# Altium project MU-RK3576J-MB.PrjPCB (part 9 of 13)

## Sheet AUDIO.SchDoc
size 420 x 297 mm; Scale: 1:1; DocumentType: Схема электрическая принципиальная; SheetNumber: 27; SheetTotal: 32; DocumentTypeShort: Э3; DocumentInvertoryNumber: ㅤ
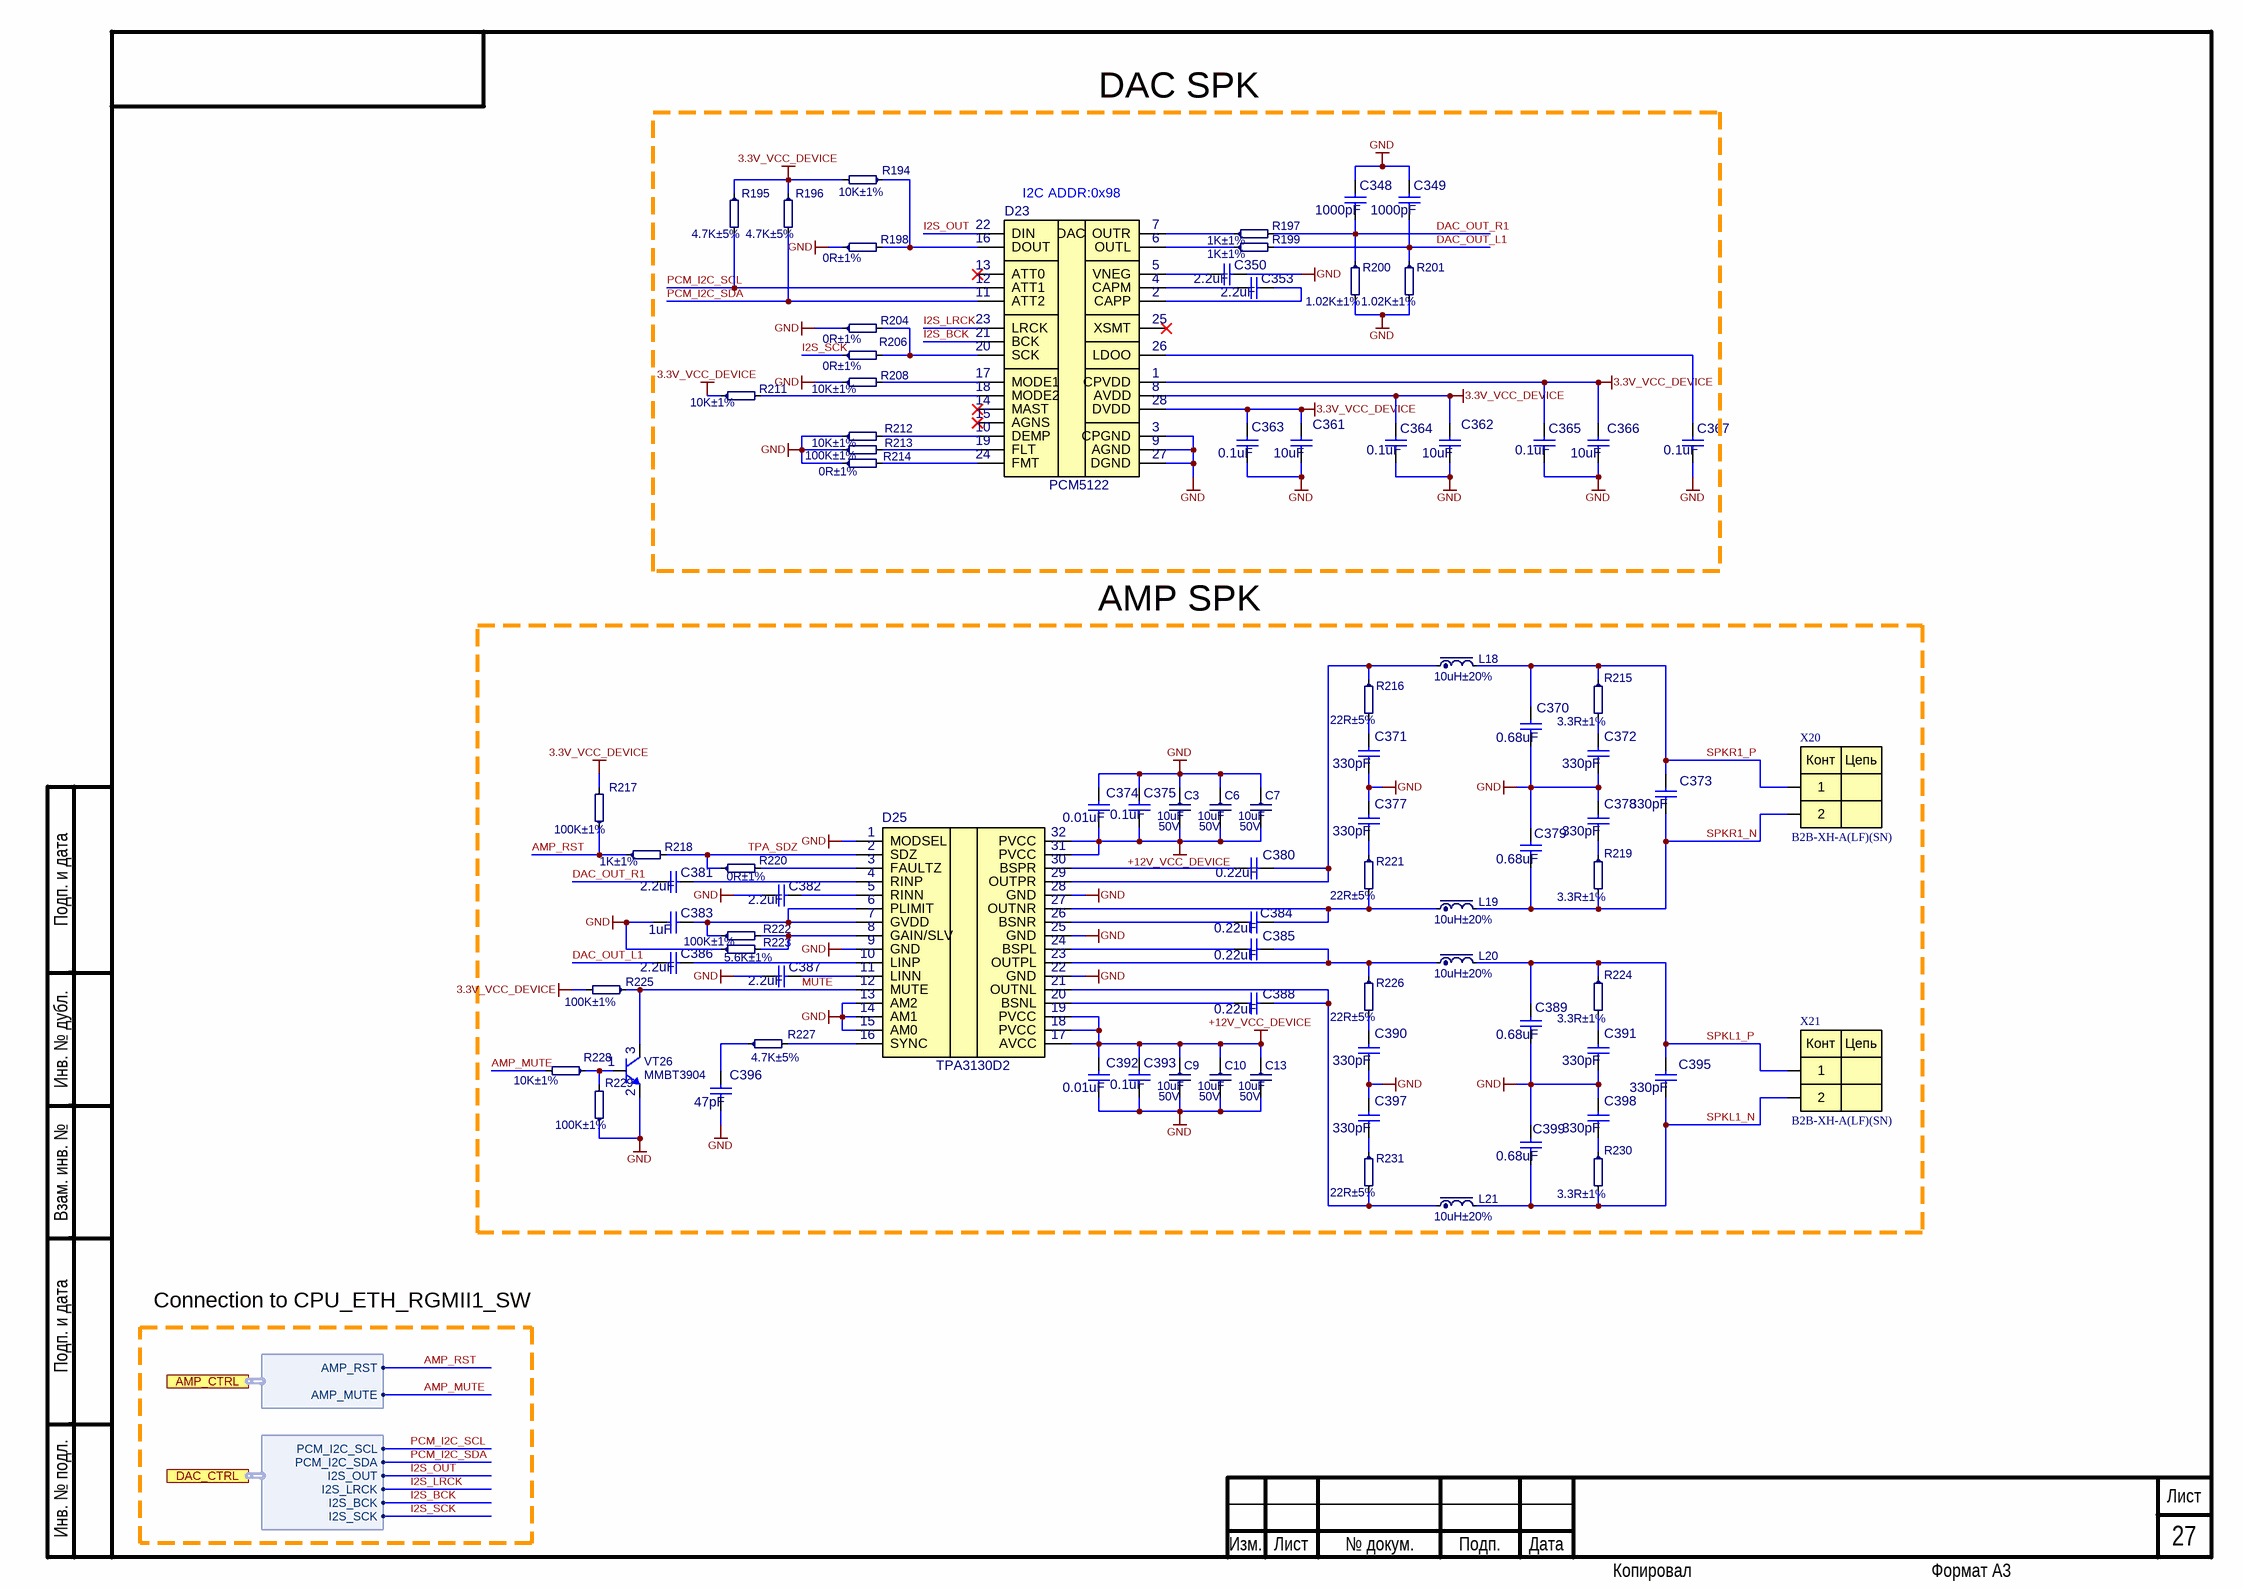
[diagram p27: AUDIO.SchDoc]

### Parts
C3  10uF  Voltage: 50V  [C1206]
C6  10uF  Voltage: 50V  [C1206]
C7  10uF  Voltage: 50V  [C1206]
C9  10uF  Voltage: 50V  [C1206]
C10  10uF  Voltage: 50V  [C1206]
C13  10uF  Voltage: 50V  [C1206]
C348  1000pF  [C0402]
C349  1000pF  [C0402]
C350  2.2uF  [C0402]
C353  2.2uF  [C0402]
C361  10uF  [C0603]
C362  10uF  [C0603]
C363  0.1uF  [C0402]
C364  0.1uF  [C0402]
C365  0.1uF  [C0402]
C366  10uF  [C0603]
C367  0.1uF  [C0402]
C370  0.68uF  [C0603]
C371  330pF  [C0603]
C372  330pF  [C0603]
C373  330pF  [C0603]
C374  0.01uF  [C0402]
C375  0.1uF  [C0402]
C377  330pF  [C0603]
C378  330pF  [C0603]
C379  0.68uF  [C0603]
C380  0.22uF  [C0603]
C381  2.2uF  [C0402]
C382  2.2uF  [C0402]
C383  1uF  [C0402]
C384  0.22uF  [C0603]
C385  0.22uF  [C0603]
C386  2.2uF  [C0402]
C387  2.2uF  [C0402]
C388  0.22uF  [C0603]
C389  0.68uF  [C0603]
C390  330pF  [C0603]
C391  330pF  [C0603]
C392  0.01uF  [C0402]
C393  0.1uF  [C0402]
C395  330pF  [C0603]
C396  47pF  [C0402]
C397  330pF  [C0603]
C398  330pF  [C0603]
C399  0.68uF  [C0603]
D23  PCM5122  [TSSOP65-28]
D25  TPA3130D2  [TSOP65P810X115-32M]
L18  10uH±20%  [MWSA0605S]
L19  10uH±20%  [MWSA0605S]
L20  10uH±20%  [MWSA0605S]
L21  10uH±20%  [MWSA0605S]
R194  10K±1%  [R0402]
R195  4.7K±5%  [R0402]
R196  4.7K±5%  [R0402]
R197  1K±1%  [R0402]
R198  0R±1%  [R0402]
R199  1K±1%  [R0402]
R200  1.02K±1%  [R0402]
R201  1.02K±1%  [R0402]
R204  0R±1%  [R0402]
R206  0R±1%  [R0402]
R208  10K±1%  [R0402]
R211  10K±1%  [R0402]
R212  10K±1%  [R0402]
R213  100K±1%  [R0402]
R214  0R±1%  [R0402]
R215  3.3R±1%  [R0603]
R216  22R±5%  [R0603]
R217  100K±1%  [R0402]
R218  1K±1%  [R0402]
R219  3.3R±1%  [R0603]
R220  0R±1%  [R0402]
R221  22R±5%  [R0603]
R222  100K±1%  [R0402]
R223  5.6K±1%  [R0402]
R224  3.3R±1%  [R0603]
R225  100K±1%  [R0402]
R226  22R±5%  [R0603]
R227  4.7K±5%  [R0402]
R228  10K±1%  [R0402]
R229  100K±1%  [R0402]
R230  3.3R±1%  [R0603]
R231  22R±5%  [R0603]
VT26  MMBT3904  [SOT23]
X20  B2B-XH-A(LF)(SN)  [B2B-XH-A(LF)(SN)]
X21  B2B-XH-A(LF)(SN)  [B2B-XH-A(LF)(SN)]

### Blocks framed on the sheet
I2C ADDR:0x98: C348-C350 C353 C361-C367 D23 R194-R201 R204 R206 R208 R211-R214

### Ports
AMP_CTRL (harness AMP_CTRL), DAC_CTRL (harness DAC_CTRL)

### Harnesses
AMP_CTRL: AMP_MUTE, AMP_RST
DAC_CTRL: PCM_I2C_SDA, PCM_I2C_SCL, I2S_OUT, I2S_LRCK, I2S_BCK, I2S_SCK

### Nets
3.3V_VCC_DEVICE: C361.2 C362.2 C363.2 C364.2 C365.2 C366.2 D23.1(CPVDD) D23.8(AVDD) D23.28(DVDD) R194.2 R195.1 R196.1 R211.1 R217.2 R225.2
+12V_VCC_DEVICE: C3.2 C6.2 C7.2 C9.1 C10.1 C13.1 C374.1 C375.1 C392.2 C393.2 D25.17(AVCC) D25.18(PVCC) D25.19(PVCC) D25.31(PVCC) D25.32(PVCC)
GND: C3.1 C6.1 C7.1 C9.2 C10.2 C13.2 C348.1 C349.1 C350.2 C361.1 C362.1 C363.1 C364.1 C365.1 C366.1 C367.1 C370.1 C371.1 C372.1 C374.2 C375.2 C377.2 C378.2 C379.2 C382.1 C383.2 C387.1 C389.1 C390.1 C391.1 C392.1 C393.1 C396.1 C397.2 C398.2 C399.2 D23.3(CPGND) D23.9(AGND) D23.27(DGND) D25.1(MODSEL) D25.9(GND) D25.13(AM2) D25.14(AM1) D25.15(AM0) D25.22(GND) D25.25(GND) D25.28(GND) R198.1 R200.2 R201.2 R204.1 R208.1 R212.1 R213.1 R214.1 R223.1 R229.1 VT26.2(E)
AMP_MUTE: R228.2 ; port AMP_CTRL.AMP_MUTE  [project net AMP_CTRL.AMP_MUTE]
AMP_RST: R217.1 R218.1 ; port AMP_CTRL.AMP_RST  [project net AMP_CTRL.AMP_RST]
DAC_OUT_L1: C349.2 C386.1 R199.2 R201.1
DAC_OUT_R1: C348.2 C381.1 R197.2 R200.1
I2S_BCK: D23.21(BCK) ; port DAC_CTRL.I2S_BCK  [project net DAC_CTRL.I2S_BCK]
I2S_LRCK: D23.23(LRCK) ; port DAC_CTRL.I2S_LRCK  [project net DAC_CTRL.I2S_LRCK]
I2S_OUT: D23.22(DIN) ; port DAC_CTRL.I2S_OUT  [project net DAC_CTRL.I2S_OUT]
I2S_SCK: R206.1 ; port DAC_CTRL.I2S_SCK  [project net DAC_CTRL.I2S_SCK]
MUTE: D25.12(MUTE) R225.1 VT26.3(C)
PCM_I2C_SCL: D23.12(ATT1) R195.2 ; port DAC_CTRL.PCM_I2C_SCL  [project net DAC_CTRL.PCM_I2C_SCL]
PCM_I2C_SDA: D23.11(ATT2) R196.2 ; port DAC_CTRL.PCM_I2C_SDA  [project net DAC_CTRL.PCM_I2C_SDA]
SPKL1_N: C395.1 C399.1 L21.2 R230.2 X21.2
SPKL1_P: C389.2 C395.2 L20.2 R224.1 X21.1
SPKR1_N: C373.1 C379.1 L19.2 R219.2 X20.2
SPKR1_P: C370.2 C373.2 L18.2 R215.1 X20.1
TPA_SDZ: D25.2(SDZ) R218.2 R220.1
NetC350_1: C350.1 D23.5(VNEG)
NetC353_1: C353.1 D23.4(CAPM)
NetC353_2: C353.2 D23.2(CAPP)
NetC367_2: C367.2 D23.26(LDOO)
NetC371_2: C371.2 R216.2
NetC372_2: C372.2 R215.2
NetC377_1: C377.1 R221.1
NetC378_1: C378.1 R219.1
NetC380_1: C380.1 D25.30(BSPR)
NetC380_2: C380.2 D25.29(OUTPR) L18.1 R216.1
NetC381_2: C381.2 D25.4(RINP)
NetC382_2: C382.2 D25.5(RINN)
NetC383_1: C383.1 D25.6(PLIMIT) D25.7(GVDD) R222.1
NetC384_1: C384.1 D25.26(BSNR)
NetC384_2: C384.2 D25.27(OUTNR) L19.1 R221.2
NetC385_1: C385.1 D25.24(BSPL)
NetC385_2: C385.2 D25.23(OUTPL) L20.1 R226.1
NetC386_2: C386.2 D25.10(LINP)
NetC387_2: C387.2 D25.11(LINN)
NetC388_1: C388.1 D25.20(BSNL)
NetC388_2: C388.2 D25.21(OUTNL) L21.1 R231.2
NetC390_2: C390.2 R226.2
NetC391_2: C391.2 R224.2
NetC396_2: C396.2 R227.1
NetC397_1: C397.1 R231.1
NetC398_1: C398.1 R230.1
NetD23_6: D23.6(OUTL) R199.1
NetD23_7: D23.7(OUTR) R197.1
NetD23_10: D23.10(DEMP) R212.2
NetD23_16: D23.16(DOUT) R194.1 R198.2
NetD23_17: D23.17(MODE1) R208.2
NetD23_18: D23.18(MODE2) R211.2
NetD23_19: D23.19(FLT) R213.2
NetD23_20: D23.20(SCK) R204.2 R206.2
NetD23_24: D23.24(FMT) R214.2
NetD25_3: D25.3(FAULTZ) R220.2
NetD25_8: D25.8(GAIN/SLV) R222.2 R223.2
NetD25_16: D25.16(SYNC) R227.2
NetR228_1: R228.1 R229.2 VT26.1(B)

Not connected (* = marked no-connect by the designer): D23 13(ATT0)* 14(MAST)* 15(AGNS)* 25(XSMT)*

### Notes on the sheet
- DAC SPK
- AMP SPK
- Connection to CPU_ETH_RGMII1_SW
- Подп. и дата
- Инв. № дубл.
- Взам. инв. №
- Инв. № подл.
- Изм.
- Лист
- № докум.
- Подп.
- Дата
- Копировал
- Формат А3
- (in symbol B2B-XH-A(LF)(SN)) Конт; Цепь
- (in symbol PCM5121) DAC

### Library data of the parts
C3 C6 C7 C9 C10 C13 = 1206-X5R-50V-010uF±10%: Manufacturer: Yageo; NameFromManufacturer: CC1206KKX5R9BB106; Dielectric: X5R; Place: *); Tolerance: 10%; Check: False; Case: C1206; Part Number: 1206-X5R-50V-010uF±10%; Value: 10uF; Temperature: -55°C~85°C; ComponentLink2Description: Link to datasheet; ComponentLink1Description: DATASHEET; ComponentLink2URL: https://www.terraelectronica.ru/product/2097656; ComponentLink1URL: Datasheets/capacitors/UPY-GPHC_X5R_4V-to-50V_27.pdf; Last changed: 27.10.2022
C348 C349 = 0402-X7R-50V-1000pF±5%: Manufacturer: Yageo; NameFromManufacturer: CC0402JRX7R9BB102; Place: S; Voltage: 50V; Tolerance: 5%; Check: False; Part Number: 0402-X7R-50V-1000pF±5%; Value: 1000pF; Temperature: -55°C~125°C; ComponentLink1Description: DATASHEET; ComponentLink1URL: https://ru.mouser.com/ProductDetail/YAGEO/CC0402JRX7R9BB102?qs=%2Fha2pyFadugad28DmURO4b2qvKgXCEL3EHEIBaCV%252BxrO6dOD1PZ5Bw%3D%3D; Datasheet: #https://www.yageo.com/upload/media/product/productsearch/datasheet/mlcc/UPY-GPHC_X7R_6.3V-to-50V_20.pdf#; Last changed: 07.10.2021
C350 C353 C381 C382 C386 C387 = 0402-X5R-16V-2.2uF±10%: *; Manufacturer: Yageo; NameFromManufacturer: CC0402KRX5R7BB225; Place: S; Voltage: 16V; Tolerance: 10%; Check: False; Part Number: 0402-X5R-16V-2.2uF±10%; Value: 2.2uF; Temperature: -55°C~85°C; ComponentLink1Description: DATASHEET; ComponentLink1URL: https://www.terraelectronica.ru/product/2082992; Datasheet: #https://www.yageo.com/upload/media/product/productsearch/datasheet/mlcc/UPY-GPHC_X5R_4V-to-50V_27.pdf#; Last changed: 23.08.2022
C361 C362 C366 = 0603-X5R-10V-10uF±20%: *; Manufacturer: Samsung Electro-Mechanics; NameFromManufacturer: CL10A106MP8NNNC; Place: S; Voltage: 10V; Tolerance: 20%; Check: False; Part Number: 0603-X5R-10V-10uF±20%; Value: 10uF; Temperature: -55°C~85°C; ComponentLink1Description: DATASHEET; ComponentLink1URL: https://www.terraelectronica.ru/product/863287; Datasheet: #https://www.terraelectronica.ru/pdf/show?pdf_file=http%253A%252F%252Fwww.farnell.com%252Fdatasheets%252F2710660.pdf#; Last changed: 30.08.2022
C363-C365 C367 C375 C393 = 0402-X5R-50V-0.1uF±10%: Manufacturer: Yageo; NameFromManufacturer: CC0402KRX5R9BB104; Place: S; Voltage: 50V; Tolerance: 10%; Check: False; Part Number: 0402-X5R-50V-0.1uF±10%; Value: 0.1uF; Temperature: -55°C~85°C; ComponentLink1Description: DATASHEET; ComponentLink1URL: https://www.yageo.com/upload/media/product/productsearch/datasheet/mlcc/UPY-GPHC_X5R_4V-to-50V_26.pdf; Datasheet: #https://www.yageo.com/upload/media/product/productsearch/datasheet/mlcc/UPY-GPHC_X5R_4V-to-50V_26.pdf#; Last changed: 16.01.2022
C370 C379 C389 C399 = 0603-X7R-25V-0.68uF±10%: Manufacturer: Yageo; NameFromManufacturer: CC0603KRX7R8BB684; Place: S; Voltage: 25V; Tolerance: 10%; Check: False; Part Number: 0603-X7R-25V-0.68uF±10%; Value: 0.68uF; Temperature: -55°C~125°C; ComponentLink1Description: DATASHEET; ComponentLink1URL: https://lcsc.com/product-detail/Multilayer-Ceramic-Capacitors-MLCC-SMD-SMT_YAGEO-CC0603KRX7R8BB684_C2838708.html; Datasheet: #https://www.yageo.com/upload/media/product/productsearch/datasheet/mlcc/UPY-GPHC_X7R_6.3V-to-50V_20.pdf#; Last changed: 22.08.2022
C371-C373 C377 C378 C390 C391 C395 C397 C398 = 0603-NP0-50V-330pF±5%: *; Manufacturer: Yageo; NameFromManufacturer: CC0603JRNPO9BN331; Place: S; Voltage: 50V; Tolerance: 5%; Check: False; Part Number: 0603-NP0-50V-330pF±5%; Value: 330pF; Temperature: -55°C~125°C; ComponentLink1Description: DATASHEET; ComponentLink1URL: https://www.terraelectronica.ru/product/709596; Datasheet: #https://www.yageo.com/upload/media/product/productsearch/datasheet/mlcc/UPY-GP_NP0_16V-to-50V_18.pdf#; Last changed: 23.08.2022
C374 C392 = 0402-X7R-50V-0.01uF±10%: Manufacturer: Yageo; NameFromManufacturer: CC0402KRX7R9BB103; Place: S; Voltage: 50V; Tolerance: 10%; Check: False; Annotation: *; Param: *; Value: 0.01uF; Part Number: 0402-X7R-50V-0.01uF±10%; Temperature: -55°C~125°C; ComponentLink1Description: DATASHEET; ComponentLink1URL: https://www.terraelectronica.ru/pdf/show?pdf_file=%252Fds%252Fpdf%252FX%252FX7R_16V-to-100V.pdf; Datasheet: #https://www.terraelectronica.ru/pdf/show?pdf_file=%252Fds%252Fpdf%252FX%252FX7R_16V-to-100V.pdf#; Last changed: 17.05.2021
C380 C384 C385 C388 = 0603-X7R-50V-0.22uF±10%: Part Number: 0603-X5R-50V-0.22uF±10%; Manufacturer: Samsung; NameFromManufacturer: CL10A224KB8NNNC; Place: S; Voltage: 50V; Tolerance: 10%; Check: False; Value: 0.22uF; Temperature: -55°C~125°C; ComponentLink1Description: DATASHEET; ComponentLink1URL: https://www.terraelectronica.ru/product/1045441; Datasheet: #https://www.yageo.com/upload/media/product/productsearch/datasheet/mlcc/UPY-GPHC_X7R_6.3V-to-50V_20.pdf#; Last changed: 18.01.2022
C383 = 0402-X5R-10V-1uF±10%: Manufacturer: Samsung; NameFromManufacturer: CL05A105KP5NNNC; Place: S; Voltage: 10V; Tolerance: 10%; Check: False; Part Number: 0402-X5R-10V-1uF±10%; Value: 1uF; Temperature: -55°C~85°C; ComponentLink1Description: DATASHEET; ComponentLink1URL: https://datasheet.ciiva.com/15195/getdatasheetpartid-358390-15195630.pdf?src-supplier=Verical; Datasheet: #https://datasheet.ciiva.com/15195/getdatasheetpartid-358390-15195630.pdf?src-supplier=Verical#; Last changed: 04.04.2021
C396 = 0402-NP0-50V-047pF±5%: Manufacturer: Yageo; NameFromManufacturer: CC0402JRNPO9BN470; Place: S; Voltage: 50V; Tolerance: 5%; Check: False; Part Number: 0402-NP0-50V-047pF±5%; Value: 47pF; Temperature: -55°C~125°C; ComponentLink1Description: DATASHEET; ComponentLink1URL: https://www.terraelectronica.ru/product/567824; Datasheet: #https://www.yageo.com/upload/media/product/productsearch/datasheet/mlcc/UPY-GP_NP0_16V-to-50V_18.pdf#; Last changed: 30.08.2022
D23 = PCM5121: 2V RMS DIRECTPATH 106dB Audio Stereo DAC with PCM interface and fixed Audio processing; Manufacturer: Texas Instruments; Place: S; Check: False; Annotation: *; Param: *; Part Number: PCM5122; Temperature: -40°C~130°C; Value: PCM5122; ComponentLink1Description: DATASHEET; NameFromManufacturer: PCM5122; ComponentLink1URL: https://www.chipdip.ru/product0/8002050004; Datasheet: #https://www.ti.com/lit/ds/symlink/pcm5121.pdf?ts=1649018753254&ref_url=https%253A%252F%252Fwww.ti.com%252Fproduct%252FPCM5121#; Last changed: 04.04.2022
D25 = TPA3130D2: TPA3130D2 Evaluation Module; Manufacturer: Texas Instruments; Place: S; Check: False; Part Number: TPA3130D2; Temperature: -40°C~85°C; Value: TPA3130D2; ComponentLink1Description: DATASHEET; NameFromManufacturer: TPA3130D2; ComponentLink1URL: https://octopart.com/tpa3130d2evm-texas+instruments-22881734?r=sp; Datasheet: #https://www.ti.com/lit/ds/slos708g/slos708g.pdf?ts=1627825887126&ref_url=https%253A%252F%252Fwww.ti.com%252Fproduct%252FTPA3116D2#; Last changed: 02.08.2021
L18-L21 = MWSA0605S-100MT: 4.4A 10uH ±20% 4.5A SMD 7x6.6mm Power Inductor; Manufacturer: Sunlord; Place: *); DC Resistance: 0.06R; Check: False; Current: 4.5A; Case: MWSA0605S; Part Number: MWSA0605S-100MT; Value: 10uH; Tolerance: 20%; Temperature: -40°C~125°C; ComponentLink1Description: DATASHEET; NameFromManufacturer: MWSA0605S-100MT; ComponentLink1URL: https://www.electronshik.ru/search?query=MWSA0605S-100MT; Last changed: 17.07.2025
R194 R208 R211 R212 R228 = 0402-0.0625W-10K-100ppm±1%: as R167 on sheet CPU_PCIE_USB_HDMI_EXT_PCIEX2_mPCIeX2; Case: R0402; Part Number: 0402-0.0625W-10K-100ppm±1%; Tolerance: 1%; Temperature: -55°C~155°C; ComponentLink1Description: DATASHEET; ComponentLink1URL: https://ru.mouser.com/ProductDetail/YAGEO/RC0402FR-0710KL?qs=%2Fha2pyFaduhjtLcYvKXQ8IogF7YwN7YtH%252BOO8ZtEEMnoa4yoWYcwpw%3D%3D; Datasheet: Datasheets/resistors/PYu-RC_Group_51_RoHS_L_11.pdf; Last changed: 27.10.2022
R195 R196 R227 = 0402-0.0625W-4.7K-100ppm±5%: NameFromManufacturer: RC0402JR-074K7L; Manufacturer: Yageo; Place: *); Value: 4.7K; Tolerance: 5%; Check: False; Case: R0402; Part Number: 0402-0.0625W-4.7K-100ppm±5%; Temperature: -55°C~155°C; ComponentLink1Description: DATASHEET; ComponentLink1URL: https://ru.mouser.com/ProductDetail/YAGEO/RC0402JR-074K7L?qs=%2Fha2pyFadugNN0LzwXn2qDR0lAGI9qruexMTkPBFwcD9DqmvUvet2g%3D%3D; Datasheet: Datasheets/resistors/PYu-RC_Group_51_RoHS_L_11.pdf; Last changed: 27.10.2022
R197 R199 R218 = 0402-0.0625W-1K-100ppm±1%: NameFromManufacturer: RC0402FR-071KL; Manufacturer: Yageo; Place: *); Value: 1K; Tolerance: 1%; Check: False; Case: R0402; Part Number: 0402-0.0625W-1K-100ppm±1%; Temperature: -55°C~155°C; ComponentLink1Description: DATASHEET; ComponentLink1URL: https://ru.mouser.com/datasheet/2/447/PYu_RC_Group_51_RoHS_L_10-1664068.pdf; Datasheet: Datasheets/resistors/PYu_RC_Group_51_RoHS_L_10-1664068.pdf; Last changed: 27.10.2022
R198 R204 R206 R214 R220 = 0402-0.0625W-0R-100ppm±1%: Chip Resistor 0402 0Ω ±1% 50V ±100ppm/℃ Thick Film; NameFromManufacturer: RC0402FR-070RL; Manufacturer: Yageo; Place: *); Value: 0R; Check: False; Case: R0402; Part Number: 0402-0.0625W-0R-100ppm±1%; Tolerance: 1%; Temperature: -55°C~155°C; ComponentLink1Description: DATASHEET; ComponentLink1URL: https://www.chipdip.ru/product0/8000617426?ysclid=l7og5x0plo427794326; Datasheet: Datasheets/resistors/DOC012445956.pdf; Last changed: 27.10.2022
R200 R201 = 0402-0.0625W-1.02K-100ppm±1%: NameFromManufacturer: RC0402FR-071K02L; Manufacturer: Yageo; Place: *); Value: 1.02K; Tolerance: 1%; Check: False; Case: R0402; Part Number: 0402-0.0625W-1.02K-100ppm±1%; Temperature: -55°C~155°C; ComponentLink1Description: DATASHEET; ComponentLink1URL: https://www.terraelectronica.ru/product/876888; Datasheet: Datasheets/resistors/PYu-RC_Group_51_RoHS_L_12.pdf; Last changed: 27.10.2022
R213 R217 R222 R225 R229 = 0402-0.0625W-100K-100ppm±1%: as R163-R166 on sheet CPU_PCIE_USB_HDMI_EXT_PCIEX2_mPCIeX2; Case: R0402; Part Number: 0402-0.0625W-100K-100ppm±1%; Tolerance: 1%; Temperature: -55°C~155°C; ComponentLink1Description: DATASHEET; ComponentLink1URL: https://www.yageo.com/upload/media/product/productsearch/datasheet/rchip/PYu-RC_Group_51_RoHS_L_11.pdf; Datasheet: Datasheets/resistors/PYu-RC_Group_51_RoHS_L_11.pdf; Last changed: 27.10.2022
R215 R219 R224 R230 = 0603-0.1W-3.3R-200ppm±1%: *; NameFromManufacturer: RC0603FR-073R3L; Manufacturer: Yageo; Place: *); Value: 3.3R; Tolerance: 1%; Check: False; Case: R0603; Part Number: 0603-0.1W-3.3R-200ppm±1%; Temperature: -55°C~155°C; ComponentLink1Description: DATASHEET; ComponentLink1URL: https://www.terraelectronica.ru/product/871121; Datasheet: Datasheets/resistors/PYu-RC_Group_51_RoHS_L_12.pdf; Last changed: 27.10.2022
R216 R221 R226 R231 = 0603-0.1W-22R-100ppm±5%: NameFromManufacturer: RC0603JR-0722RL; Manufacturer: Yageo; Place: *); Value: 22R; Tolerance: 5%; Check: False; Case: R0603; Part Number: 0603-0.1W-22R-100ppm±5%; Temperature: -55°C~155°C; ComponentLink1Description: DATASHEET; ComponentLink1URL: https://www.terraelectronica.ru/product/328449; Datasheet: Datasheets/resistors/PYu-RC_Group_51_RoHS_L_12.pdf; Last changed: 27.10.2022
R223 = 0402-0.0625W-5.6K-100ppm±1%: *; NameFromManufacturer: RC0402FR-075K6L; Manufacturer: Yageo; Place: *); Value: 5.6K; Tolerance: 1%; Check: False; Case: R0402; Part Number: 0402-0.0625W-5.6K-100ppm±1%; Temperature: -40°C~155°C; ComponentLink1Description: DATASHEET; ComponentLink1URL: https://www.terraelectronica.ru/product/361844; Datasheet: Datasheets/resistors/PYu-RC_Group_51_RoHS_L_12.pdf; Last changed: 27.10.2022
VT26 = MMBT3904: as VT22-VT25 on sheet CPU_PCIE_USB_HDMI_EXT_PCIEX2_mPCIeX2; Part Number: MMBT3904; Value: MMBT3904; Temperature: -55°C~150°C; ComponentLink1Description: DATASHEET; NameFromManufacturer: MMBT3904; ComponentLink1URL: https://www.terraelectronica.ru/product/607582; Datasheet: #https://diotec.com/request/datasheet/mmbt3904.pdf#; Last changeв: 01.09.2022
X20 X21 = B2B-XH-A(LF)(SN): Connector Header 2 position 2.5mm Pitch 3A Through Hole -25℃~+85℃; Manufacturer: JST; Check: False; Value: B2B-XH-A(LF)(SN); Availability: Unavailable; Price: None; Package: None; MP: B2B-XH-A(LF)(SN); Part Number: B2B-XH-A(LF)(SN); NameFromManufacturer: B2B-XH-A(LF)(SN)